# Altium project WirelessCharger.PrjPcb
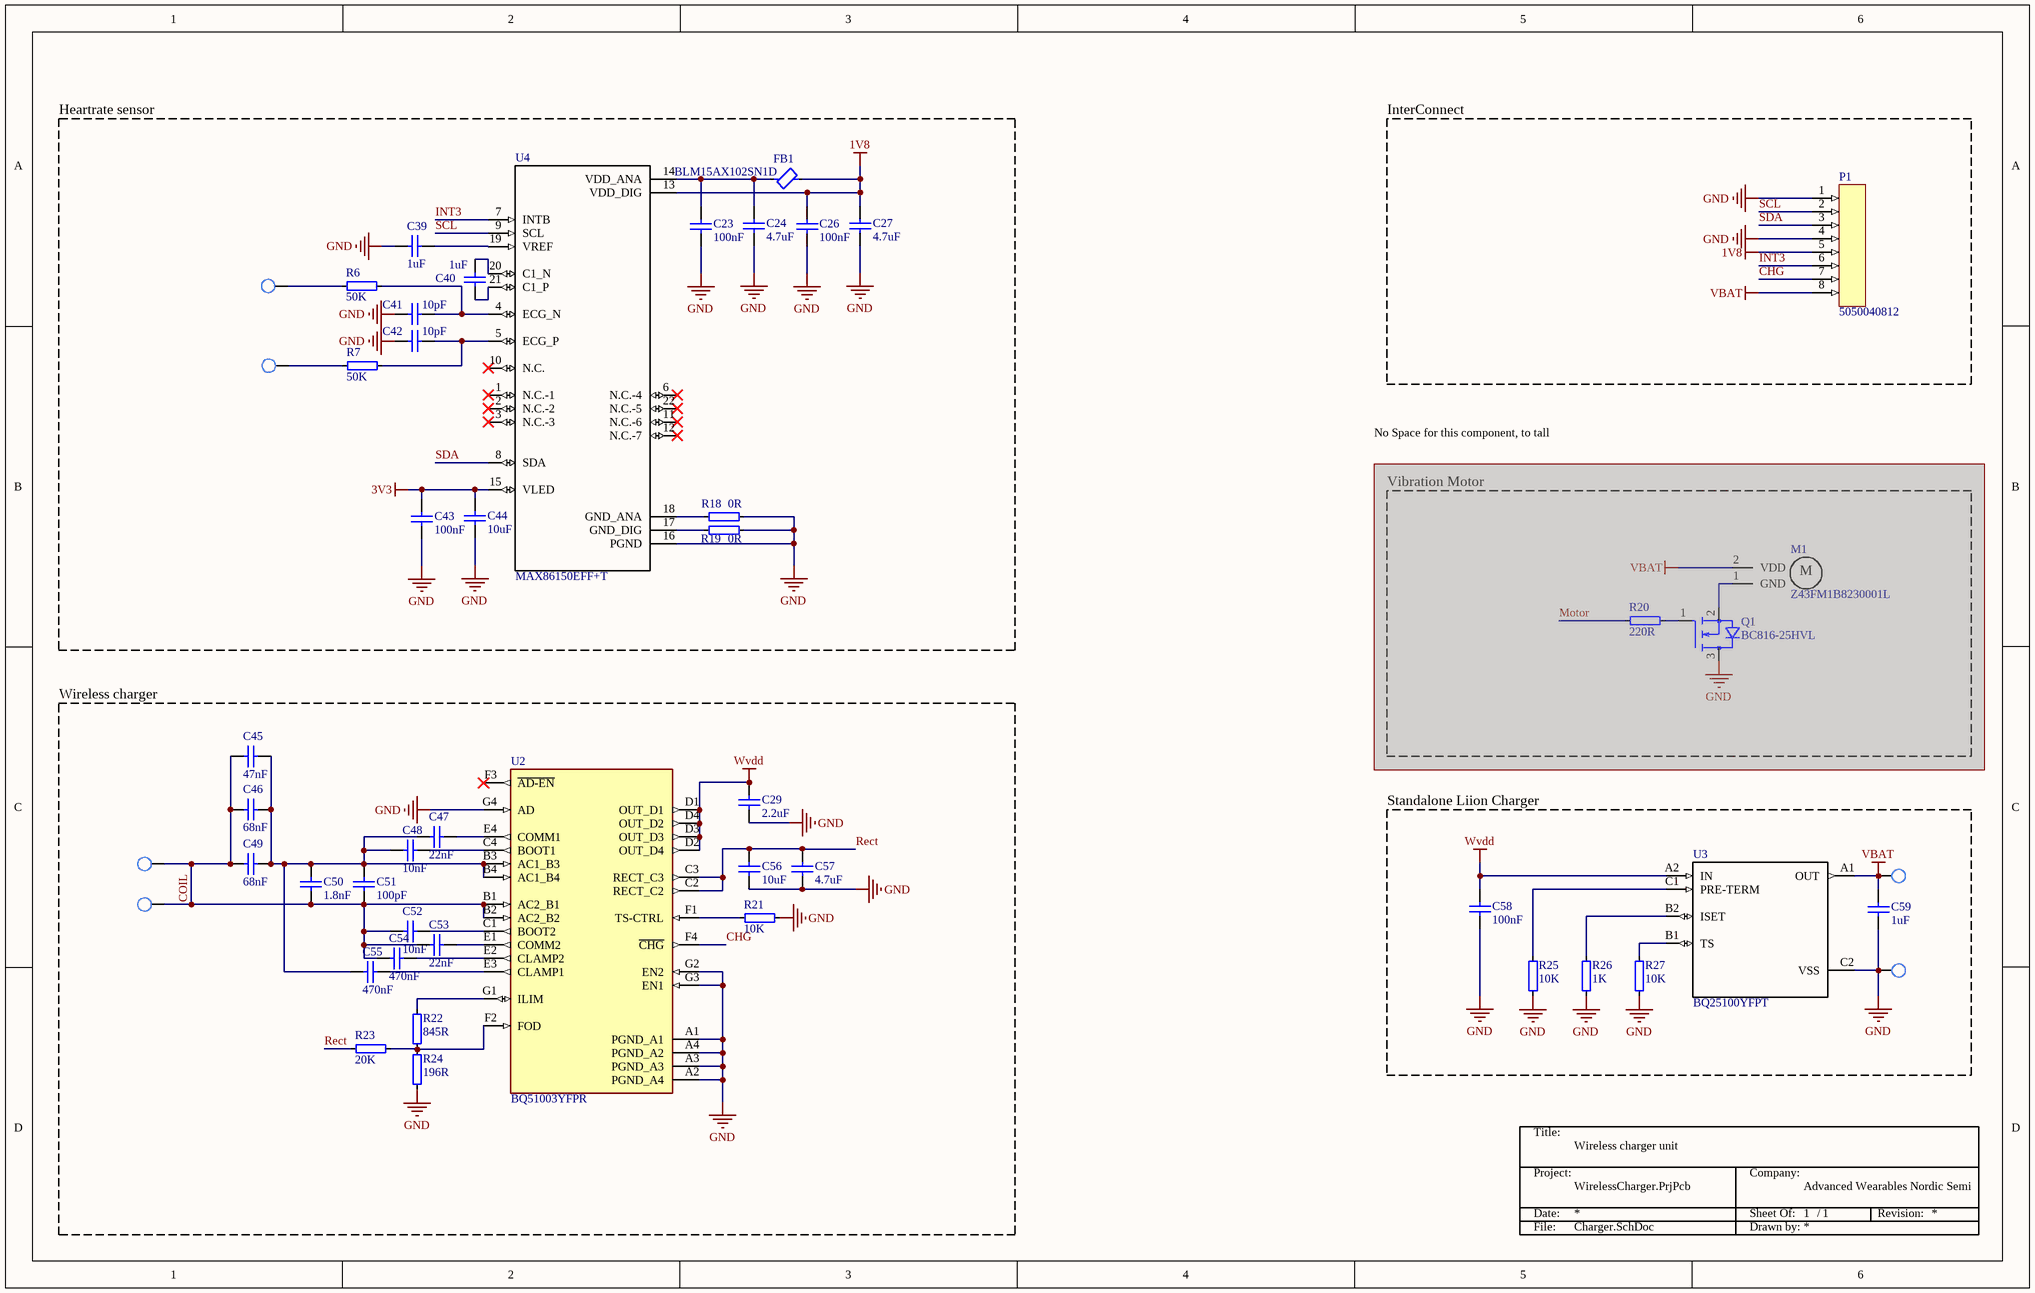
[diagram p0: Charger.SchDoc]
1 sheet, 52 parts. Net scope: global (net labels, ports and power ports of the same name join across sheets).
Board file: SensCharger.PcbDoc

## Sheet Charger.SchDoc: Wireless charger unit
size B; Organization: Advanced Wearables Nordic Semi; SheetNumber: 1; SheetTotal: 1

### Parts
*  TitleBlock  (value not drawn)  (graphical)
C23  100nF  [C0402]
C24  4.7uF  [C0402]
C26  100nF  [C0402]
C27  4.7uF  [C0402]
C29  2.2uF  [C0603]
C39  1uF  [C0402]
C40  1uF  [C0402]
C41  10pF  [C0402]
C42  10pF  [C0402]
C43  100nF  [C0402]
C44  10uF  [C0603]
C45  47nF  [C0402]
C46  68nF  [C0402]
C47  22nF  [C0402]
C48  10nF  [C0402]
C49  68nF  [C0402]
C50  1.8nF  [C0402]
C51  100pF  [C0402]
C52  10nF  [C0402]
C53  22nF  [C0402]
C54  470nF  [C0402]
C55  470nF  [C0402]
C56  10uF  [C0603]
C57  4.7uF  [C0603]
C58  100nF  [C0402]
C59  1uF  [C0402]
Coil1  DNP  [TP_SMD_1.0mm]  (value not drawn)
Coil2  DNP  [TP_SMD_1.0mm]  (value not drawn)
FB1  BLM15AX102SN1D  [IND0402]
GND  DNP  [TP_SMD_1.0mm]  (value not drawn)
M1  Z43FM1B8230001L  [Z43FM1B8230001L]  (masked out: inside a compile mask, not in the netlist)
P1  5050040812  [5050040812]
Q1  BC816-25HVL  [SOT23-3]  (masked out: inside a compile mask, not in the netlist)
R6  50K  [RES0402]
R7  50K  [RES0402]
R18  0R  [RES0402]
R19  0R  [RES0402]
R20  220R  [RES0603R]  (masked out: inside a compile mask, not in the netlist)
R21  10K  [RES0402]
R22  845R  [RES0402]
R23  20K  [RES0402]
R24  196R  [RES0402]
R25  10K  [RES0402]
R26  1K  [RES0402]
R27  10K  [RES0402]
TP1  DNP  [TP_SMD_1.0mm]  (value not drawn)
TP2  DNP  [TP_SMD_1.0mm]  (value not drawn)
U2  BQ51003YFPR  [BQ51003]
U3  BQ25100YFPT  [BQ25100YFP]
U4  MAX86150EFF+T  [MAX86150EFF+]
VBAT  DNP  [TP_SMD_1.0mm]  (value not drawn)

### Blocks framed on the sheet
Heartrate sensor: C23 C24 C26 C27 C39-C44 FB1 R6 R7 R18 R19 TP1 TP2 U4
InterConnect: P1
Vibration Motor: M1 Q1 R20
Wireless charger: C29 C45-C57 Coil1 Coil2 R21-R24 U2
Standalone Liion Charger: C58 C59 GND R25-R27 U3 VBAT

### Nets
1V8: C26.2 C27.2 FB1.2 P1.5 U4.13(VDD_DIG)
3V3: C43.2 C44.2 U4.15(VLED)
GND: C23.1 C24.1 C26.1 C27.1 C29.2 C39.2 C41.1 C42.1 C43.1 C44.1 C56.2 C57.2 C58.2 C59.2 GND.1 P1.1 P1.4 R18.2 R19.2 R21.1 R24.1 R25.1 R26.1 R27.1 U2.A1(PGND_A1) U2.A2(PGND_A4) U2.A3(PGND_A3) U2.A4(PGND_A2) U2.G2(EN2) U2.G3(EN1) U2.G4(AD) U3.C2(VSS) U4.16(PGND)
VBAT: C59.1 P1.8 U3.A1(OUT) VBAT.1
Wvdd: C29.1 C58.1 U2.D1(OUT_D1) U2.D2(OUT_D4) U2.D3(OUT_D3) U2.D4(OUT_D2) U3.A2(IN)
CHG: P1.7 U2.F4(~{CHG})
COIL: C45.2 C46.2 C49.2 C50.2 C51.2 C52.2 C53.2 C54.2 Coil1.1 Coil2.1 U2.B1(AC2_B1) U2.B2(AC2_B2)
INT3: P1.6 U4.7(INTB)
Rect: C56.1 C57.1 R23.2 U2.C2(RECT_C2) U2.C3(RECT_C3)
SCL: P1.2 U4.9(SCL)
SDA: P1.3 U4.8(SDA)
NetC23_2: C23.2 C24.2 FB1.1 U4.14(VDD_ANA)
NetC39_1: C39.1 U4.19(VREF)
NetC40_1: C40.1 U4.20(C1_N)
NetC40_2: C40.2 U4.21(C1_P)
NetC41_2: C41.2 R6.2 U4.4(ECG_N)
NetC42_2: C42.2 R7.2 U4.5(ECG_P)
NetC45_1: C45.1 C46.1 C47.2 C48.2 C49.1 C50.1 C51.1 C55.2 U2.B3(AC1_B3) U2.B4(AC1_B4)
NetC47_1: C47.1 U2.E4(COMM1)
NetC48_1: C48.1 U2.C4(BOOT1)
NetC52_1: C52.1 U2.C1(BOOT2)
NetC53_1: C53.1 U2.E1(COMM2)
NetC54_1: C54.1 U2.E2(CLAMP2)
NetC55_1: C55.1 U2.E3(CLAMP1)
NetR6_1: R6.1 TP1.1
NetR7_1: R7.1 TP2.1
NetR18_1: R18.1 U4.18(GND_ANA)
NetR19_1: R19.1 U4.17(GND_DIG)
NetR21_2: R21.2 U2.F1(TS-CTRL)
NetR22_1: R22.1 R23.1 R24.2 U2.F2(FOD)
NetR22_2: R22.2 U2.G1(ILIM)
NetR25_2: R25.2 U3.C1(PRE-TERM)
NetR26_2: R26.2 U3.B2(ISET)
NetR27_2: R27.2 U3.B1(TS)

Not connected (* = marked no-connect by the designer): U2 F3(~{AD-EN})*; U4 1(N.C.-1)* 2(N.C.-2)* 3(N.C.-3)* 6(N.C.-4)* 10(N.C.)* 11(N.C.-6)* 12(N.C.-7)* 22(N.C.-5)*

### Notes on the sheet
- No Space for this component, to tall
- (in symbol TitleBlock) Title:; Project:; Company:; Date:; Sheet Of:; /; Revision:; File:; Drawn by:
- (in symbol Vibration Motor) M

### Library data of the parts
C23 C24 C26 C27 C29 C39-C50 C52-C59 = CAP: Capacitor; Value: 100pF; Published: 8-Jun-2000; Revision: July-2002: Re-released for DXP Platform.; Publisher: Altium Limited
C51 = CAP: Capacitor; Published: 8-Jun-2000; Revision: July-2002: Re-released for DXP Platform.; Publisher: Altium Limited; Value: 100pF
Coil1 Coil2 GND TP1 TP2 VBAT = TP
FB1 = FerrideBead: Ferrite Bead, 1000 Ohm @ 100MHz; Part Number: FB0402-120R@100M-500mA; Manufacturer: Murata; Manufacturer Part Number: BLM15AG121SN1D; Part number IPS: N.A.; Value: 120R/0.55A; Note: Chip EMIFIL Inductor Type Chip Ferrite Bead; Artikkelnr Noca: 33029317; Footprint Doc: 0402; LatestRevisionDate: 2014-01-10; Pin Count: 2; Publisher: Nordic Semiconductor; Published: 2011-11-14; ComponentLink1URL: *; ComponentLink1Description: Datasheet; ComponentLink2URL: *; ComponentLink2Description: Supplier link; HelpURL: http://search.murata.co.jp/Ceramy/image/img/PDF/ENG/L0110S0100BLM15A_SN.pdf
M1 = Vibration Motor: SMD Vibration Motor / https://www.vibration-motor.com/cylindrical-vibrator-motors/smt-surface-mount-reflow/z43fm1b8230001l; ComponentLink1Description: Manufacturer; ComponentLink1URL: https://www.vibration-motor.com/cylindrical-vibrator-motors/smt-surface-mount-reflow/z43fm1b8230001l
P1 = 8 Pin Connector: Generic 8 pin connector, see footprint for MPN
Q1 = Transistor: N-Channel 20V 100mA _Ta_ 150mW _Ta_ Surface Mount VMT3; MF: Rohm; MP: RUM001L02T2CL; Value: *; SnapEDA_Link: https://www.snapeda.com/parts/RUM001L02T2CL/Rohm/view-part/531428/?ref=snap; Digi-Key_Part_Number: RUM001L02T2CLCT-ND; Digi-Key_Purchase_URL: https://www.digikey.com/product-detail/en/rohm-semiconductor/RUM001L02T2CL/RUM001L02T2CLCT-ND/4571412?utm_source=snapeda&utm_medium=aggregator&utm_campaign=symbol; Package: SOT-723 Rohm
R6 R7 R20-R27 = RES: Resistor, ±5%, 0.05W; Part Number: R0201-0R; Part number IPS: 00000003245; Value: 0R; Note: Chip Res 5%; Artikkelnr Noca: N.A.; Manufacturer: *; Manufacturer Part Number: *; ComponentLink1URL: *; ComponentLink1Description: Datasheet; ComponentLink2URL: *; ComponentLink2Description: Supplier link; HelpURL: *; Footprint Doc: 0201; LatestRevisionDate: 2017-11-09; Pin Count: 2; Publisher: Nordic Semiconductor; Published: 2014-11-13; Supplier 1: *; Supplier Part Number 1: *; Supplier 2: *; Supplier Part Number 2: *
R18 R19 = RES: Resistor, ±5%, 0.05W; Part Number: R0201-0R; Part number IPS: 00000003245; Note: Chip Res 5%; Artikkelnr Noca: N.A.; Manufacturer: *; Manufacturer Part Number: *; ComponentLink1URL: *; ComponentLink1Description: Datasheet; ComponentLink2URL: *; ComponentLink2Description: Supplier link; HelpURL: *; Footprint Doc: 0201; LatestRevisionDate: 2017-11-09; Pin Count: 2; Publisher: Nordic Semiconductor; Published: 2014-11-13; Value: 0R; Supplier 1: *; Supplier Part Number 1: *; Supplier 2: *; Supplier Part Number 2: *
U2 = BQ51003YFPR: BQ51003 Wireless power Receiver 28-DSBGA -40 to 85; Package: None; Value: *; MP: BQ51003YFPR; Availability: Unavailable; Price: None
U3 = BQ25100YFPT: Standalone 1-cell, 250-mA linear battery charger with 4.2-V charge voltage and prog. pre-charge 6-DSBGA 0 to 125; MF: Texas Instruments; DigiKey-Purchase-URL: https://snapeda.com/shop?store=DigiKey&id=251118; Mouser-Purchase-URL: https://snapeda.com/shop?store=Mouser&id=251118; SnapEDA_Link: https://www.snapeda.com/parts/BQ25100YFPT/Texas%20Instruments/view-part/251118/?ref=snap; Digi-Key_Part_Number: 296-38373-1-ND; MP: BQ25100YFPT; Value: *; Texas_Instruments-Purchase-URL: https://snapeda.com/shop?store=Texas+Instruments&id=251118; Package: DSBGA-6 Texas Instruments
U4 = MAX86150EFF+T: Oximeter/Heart Rate Sensor IÂ²C Output; MF: Maxim Integrated; Package: OLGA-22 Maxim; MP: MAX86150EFF+; Availability: Unavailable; Price: None; Value: *; SnapEDA_Link: https://www.snapeda.com/parts/MAX86150EFF%2B/Maxim%20Integrated/view-part/680829/?ref=snap